# Altium project PMODBob.PrjPcb
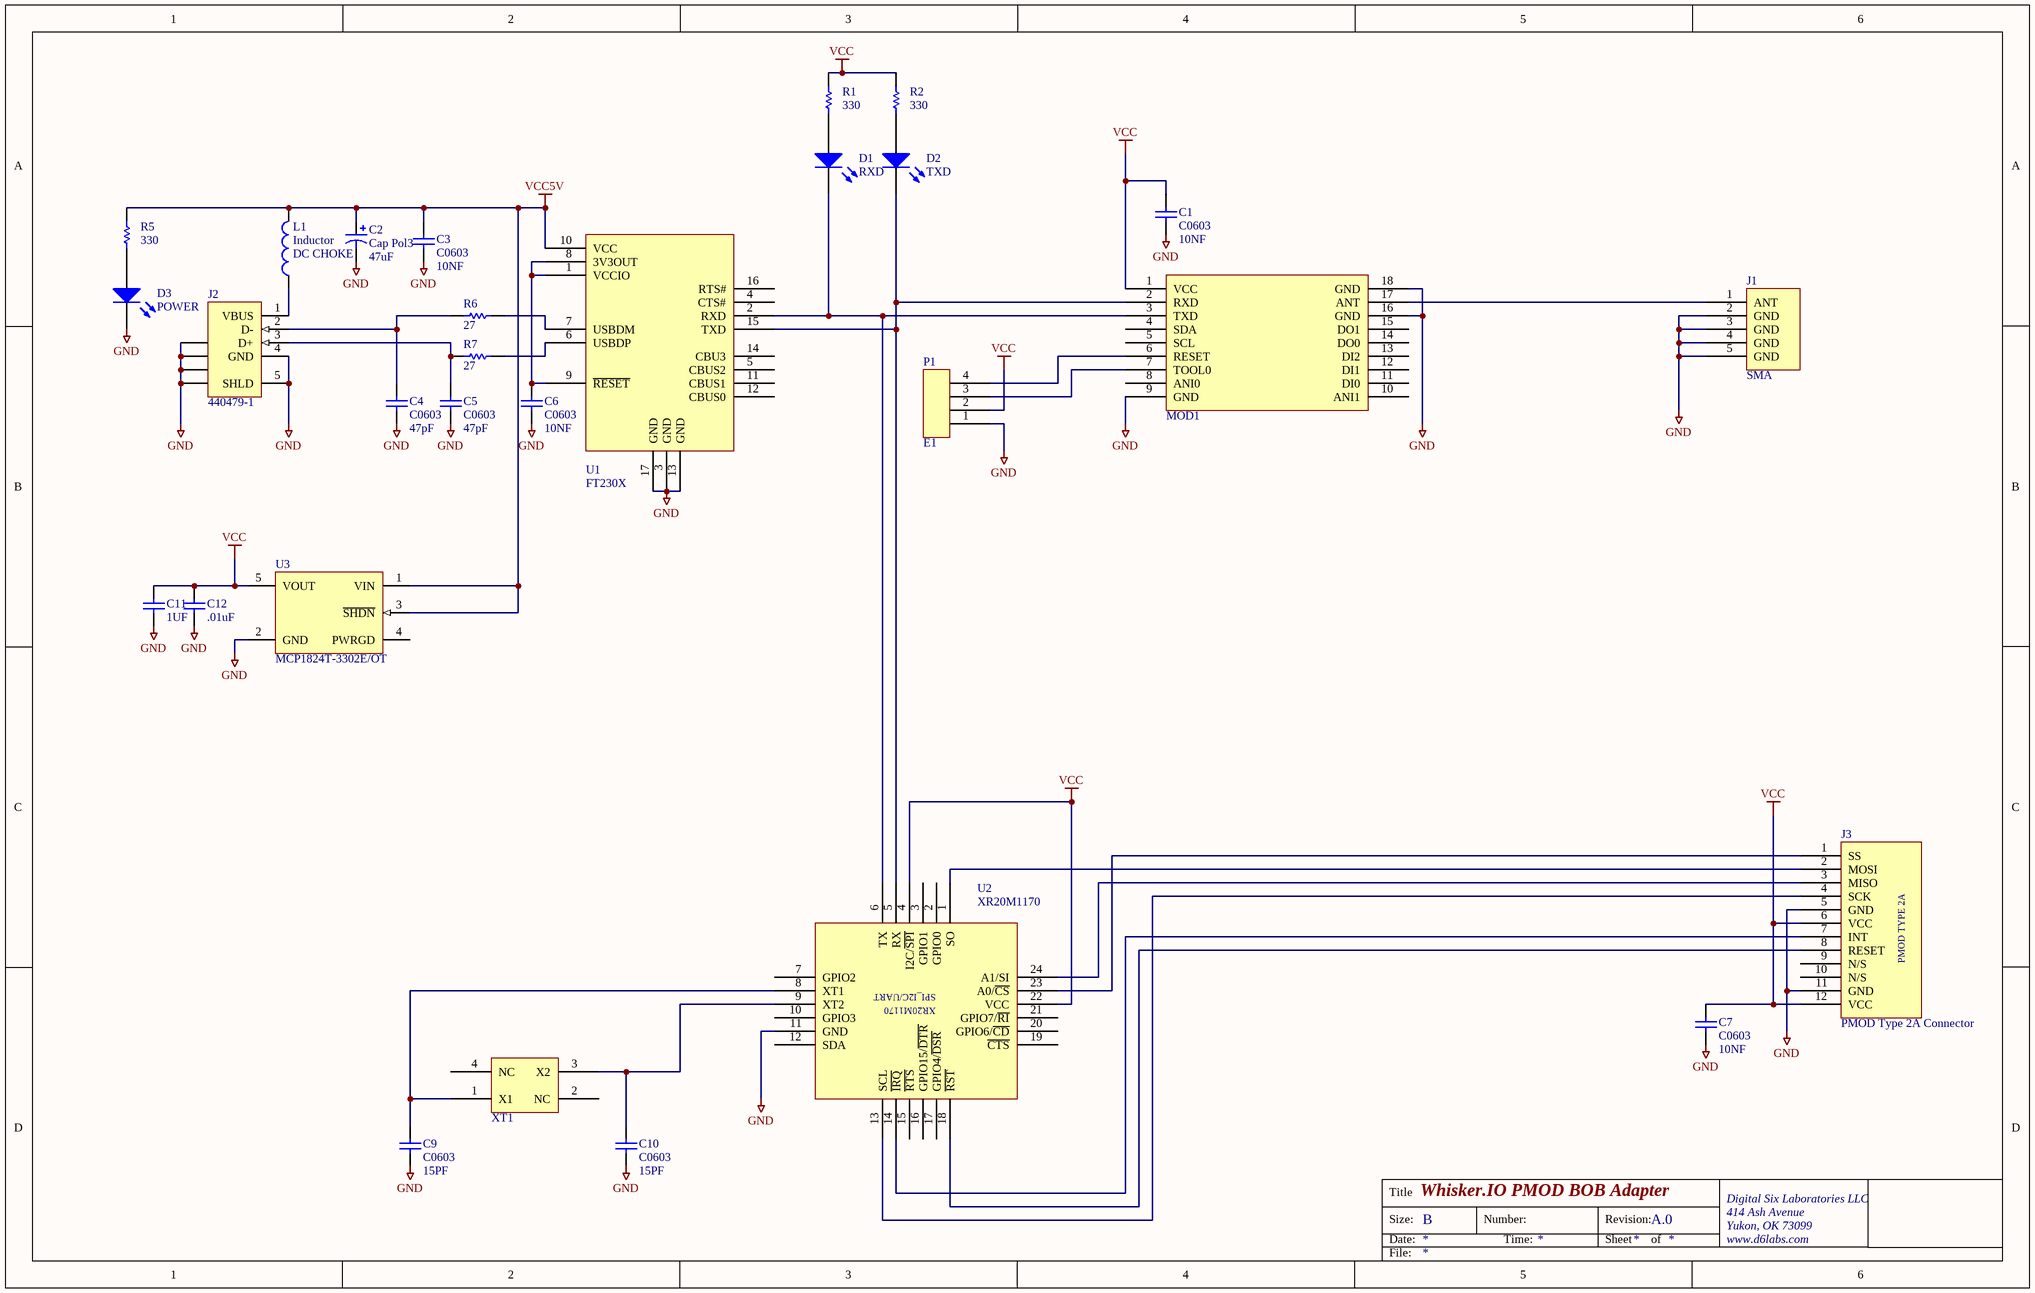
[diagram p0: PMODBob.SchDoc]
1 sheet, 29 parts. Net scope: global (net labels, ports and power ports of the same name join across sheets).
Board files: PMODBob.PcbDoc, opensourcehw_logo.PcbDoc

## Sheet PMODBob.SchDoc: Whisker.IO PMOD BOB Adapter
size B; Author: SJM; CompanyName: Digital Six Laboratories LLC; DrawnBy: SJM; Engineer: SJM; Address1: Digital Six Laboratories LLC; Address2: 414 Ash Avenue; Address3: Yukon, OK 73099; Address4: www.d6labs.com; Revision: A.0; PageSetup: Record=PageOptions|CenterHorizontal=True|CenterVertical=True|PrintScale=0.70|XCorrection=1.00|YCorrection=1.00|PrintKind=2|BorderSize=5000000|LeftOffset=0|BottomOffset=0|Orientation=2|PaperLength=4318|PaperWidth=2794|Scale=100|PaperSource=2|PrintQuality=-4|MediaType=1|DitherType=10|PaperKind=Letter|PrintScaleMode=1; DocumentName: PMOD BOB Adapter

### Parts
C1  C0603  value 10NF  [0603]
C2  Cap Pol3  value 47uF  [1812]
C3  C0603  value 10NF  [0603]
C4  C0603  value 47pF  [0603]
C5  C0603  value 47pF  [0603]
C6  C0603  value 10NF  [0603]
C7  C0603  value 10NF  [0603]
C9  C0603  value 15PF  [0603]
C10  C0603  value 15PF  [0603]
C11  1UF  [D6_0603_RES]
C12  .01uF  [D6_0603_RES]
D1  RXD  [3.2X1.6X1.1]
D2  TXD  [3.2X1.6X1.1]
D3  POWER  [3.2X1.6X1.1]
J1  SMA  [RPSMA-EDGEMOUNT]
J2  440479-1  [440479]
J3  PMOD Type 2A Connector  [Type2A]
L1  Inductor  value DC CHOKE  [INDC1608L]
MOD1  WhiskerModule  [whisker]  (value not drawn)
P1  E1  [2MM4PINHDR]
R1  330  [ERA-0603]
R2  330  [ERA-0603]
R5  330  [ERA-0603]
R6  27  [ERA-0603]
R7  27  [ERA-0603]
U1  FT230X  [QFN65P400X400X75-16N]
U2  XR20M1170  [QFN50P400X400X80-24N]
U3  MCP1824T-3302E/OT  [SOT-23-OT5_N]
XT1  2.5X3.2MM  [2.5x3.2]  (value not drawn)

### Nets
GND: C1.1 C2.2 C3.1 C4.1 C5.1 C6.1 C7.1 C9.1 C10.1 C11.1 C12.1 D3.2(K) J1.2(GND) J1.3(GND) J1.4(GND) J1.5(GND) J2.4(GND) J2.5(SHLD) J2.6(SHLD) J2.7(SHLD) J2.8(SHLD) J2.9(SHLD) J3.5(GND) J3.11(GND) MOD1.9(GND) MOD1.16(GND) MOD1.18(GND) P1.1(RESET) U1.3(GND) U1.13(GND) U1.17(GND) U2.11(GND) U3.2(GND)
VCC: C1.2 C7.2 C11.2 C12.2 J3.6(VCC) J3.12(VCC) MOD1.1(VCC) P1.2(RESET) R1.1 R2.1 U2.4(I2C/~{SPI}) U2.22(VCC) U3.5(VOUT)
VCC5V: C2.1 C3.2 L1.2 R5.1 U1.10(VCC) U3.1(VIN) U3.3(~{SHDN})
NetC4_2: C4.2 J2.2(D-) R6.2
NetC5_2: C5.2 J2.3(D+) R7.2
NetC6_2: C6.2 U1.1(VCCIO) U1.8(3V3OUT) U1.9(~{RESET})
NetC9_2: C9.2 U2.8(XT1) XT1.1(X1)
NetC10_2: C10.2 U2.9(XT2) XT1.3(X2)
NetD1_1: D1.1(A) R1.2
NetD1_2: D1.2(K) MOD1.3(TXD) U1.2(RXD) U2.6(TX)
NetD2_1: D2.1(A) R2.2
NetD2_2: D2.2(K) MOD1.2(RXD) U1.15(TXD) U2.5(RX)
NetD3_1: D3.1(A) R5.2
NetJ1_1: J1.1(ANT) MOD1.17(ANT)
NetJ2_1: J2.1(VBUS) L1.1
NetJ3_1: J3.1(SS) U2.23(A0/~{CS})
NetJ3_2: J3.2(MOSI) U2.1(SO)
NetJ3_3: J3.3(MISO) U2.24(A1/SI)
NetJ3_4: J3.4(SCK) U2.13(SCL)
NetJ3_7: J3.7(INT) U2.14(~{IRQ})
NetJ3_8: J3.8(RESET) U2.18(~{RST})
NetMOD1_6: MOD1.6(RESET) P1.4(RESET)
NetMOD1_7: MOD1.7(TOOL0) P1.3(RESET)
NetR6_1: R6.1 U1.7(USBDM)
NetR7_1: R7.1 U1.6(USBDP)

Not connected (* = marked no-connect by the designer): J3 9(N/S) 10(N/S); MOD1 4(SDA) 5(SCL) 8(ANI0) 10(ANI1) 11(DI0) 12(DI1) 13(DI2) 14(DO0) 15(DO1); U1 4(CTS#) 5(CBUS2) 11(CBUS1) 12(CBUS0) 14(CBU3) 16(RTS#); U2 2(GPIO0) 3(GPIO1) 7(GPIO2) 10(GPIO3) 12(SDA) 15(~{RTS}) 16(GPIO15/~{DTR}) 17(GPIO4/~{DSR}) 19(~{CTS}) 20(GPIO6/~{CD}) 21(GPIO7/~{RI}); U3 4(PWRGD); XT1 2(NC) 4(NC)

### Notes on the sheet
- Title
- Size:
- Date:
- B
- Number:
- Time:
- Revision:
- Sheet
- of
- File:
- (in symbol PMOD Type 2A Connector) PMOD TYPE 2A
- (in symbol XR20M1170) SPI_I2C/UART

### Library data of the parts
C1 C3 C6 C7 = C0603: Ceramic Chip Capacitor - Standard; VENDOR PART NUMBER: 140-CC504B103K-RC; MANUFACTURER: XICON; VENDOR: MOUSER; COST EACH: .008; MANUFACTURER PART NUMBER: 140-CC504B103K-RC
C2 = Cap Pol3: Polarized Capacitor (Surface Mount); VENDOR PART NUMBER: 647-F930J336MBA; MANUFACTURER: AVX; MANUFACTURER PART NUMBER: 647-647-F930J336MBA; VENDOR: MOUSER; COST EACH: .19
C4 C5 C9 C10 = C0603: Ceramic Chip Capacitor - Standard; VENDOR PART NUMBER: 140-CC504N470J-RC; MANUFACTURER: XICON; VENDOR: MOUSER; COST EACH: .009; MANUFACTURER PART NUMBER: 140-CC504N470J-RC
C11 C12 = C1210: Ceramic Chip Capacitor - Standard; MANUFACTURER: VISHAY; MANUFACTURER PART NUMBER: VJ0603A150JXACW1BC; VENDOR PART NUMBER: 77-VJ0603A150JXACW1BC; VENDOR: MOUSER; COST EACH: .02
D1-D3 = LED2: Typical RED, GREEN, YELLOW, AMBER GaAs LED; Published: 8-Jun-2000; LatestRevisionDate: 17-Jul-2002; LatestRevisionNote: Re-released for DXP Platform.; PackageVersion: Feb-2002; PackageReference: 3.2X1.6X1.1; Publisher: Altium Limited; PackageDescription: SM LED; 2 Flat Leads
J2 = 440479-1: USB 2.0, Right Angle, SMT, AB Type, Receptacle, 5 Position, Black; ContactMaterial: Phosphor Bronze; ContactPlating: Gold (30) over Nickel; PCB_Layout: Complies with manufacturer's recommendation.; DrillSize: Corresponds to nominal value.; PanelGround: Without; Published: 15-Jul-2004; DatasheetDocument: 28-Jan-2003; PackageDocument: 28-Jan-2003; PackageReference: 440479; Publisher: Altium Limited; HousingMaterial: Thermoplastic; ComponentLink1Description: Manufacturer Link; ComponentLink1URL: http://www.tycoelectronics.com/; ComponentLink2Description: Packaging Specification; ComponentLink2URL: http://ecommas.tycoelectronics.com/commerce/DocumentDelivery/DDEController?Action=showdoc&DocId=Customer+Drawing%7F440479%7FD%7Fpdf%7FEnglish%7FC_440479_D.pdf
L1 = Inductor: MANUFACTURER: TDK; MANUFACTURER PART NUMBER: MPZ1608D101B; VENDOR PART NUMBER: 810-MPZ1608D101B; COST EACH: .025; VENDOR: TDK
MOD1 = WhiskerModule: Whisker Footprint
P1 = 2MM4PINHDR
R1 R2 R5 = ERA3Y: Rectangular Thick Film Chip Resistor, 10 Ohm to 330k Ohm Range, 0.1% and 0.5% Tolerance, 0603 Size, 0.063 W; VENDOR PART NUMBER: 301-330-RC; MANUFACTURER: XICON; VENDOR: MOUSER; COST EACH: .003; MANUFACTURER PART NUMBER: 301-330-RC
R6 R7 = ERA3Y: Rectangular Thick Film Chip Resistor, 10 Ohm to 330k Ohm Range, 0.1% and 0.5% Tolerance, 0603 Size, 0.063 W; VENDOR PART NUMBER: 301-27-RC; MANUFACTURER: XICON; VENDOR: MOUSER; COST EACH: .003; MANUFACTURER PART NUMBER: 301-27-RC
U1 = FT230X: FT230X USB TO BASIC UART IC; MANUFACTURER: FTDI; MANUFACTURER PART NUMBER: FT230XQ; VENDOR PART NUMBER: 895-FT230XQ-R; VENDOR: MOUSER; COST EACH: 2.04
U2 = XR20M1170: I2C/SPI UART with 64-byte FIFO; MANUFACTURER: EXAR; MANUFACTURER PART NUMBER: XR20M1170IL24-F; VENDOR PART NUMBER: 701-XR20M1170IL24-F; VENDOR: MOUSER; COST EACH: 2.96
U3 = MCP1824T-3302E/OT: 300 mA, Low Voltage, Low Quiescent Current LDO Regulator, 5-Pin SOT-23, Extended Temperature, Tape and Reel; Published: 29-Jan-2009; DatasheetVersion: revA, Aug-2007; PackageVersion: revBB, Aug-2009; PackageReference: SOT-23-OT5; Publisher: Altium Limited; PackageDescription: 5-Lead Plastic Small Outline Transistor (OT) [SOT-23]; Supplier 1: Digi-Key; Supplier Part Number 1: MCP1824T-3302E/OTTR-ND; Supplier 2: Digi-Key; Supplier Part Number 2: MCP1824T-3302E/OTCT-ND; Supplier 3: Digi-Key; Supplier Part Number 3: MCP1824T-3302E/OTDKR-ND; Supplier 4: Farnell; Supplier Part Number 4: 1578387; Code_IPC: SOT23-5; ComponentLink1Description: Datasheet; ComponentLink1URL: http://ww1.microchip.com/downloads/en/DeviceDoc/22070a.pdf; ComponentLink2Description: Packaging Specification; ComponentLink2URL: http://www.microchip.com/stellent/groups/techpub_sg/documents/packagingspec/en012702.pdf; ComponentLink3Description: Microchip.com Home; ComponentLink3URL: http://www.microchip.com/
XT1 = 2.5X3.2MM: 3.2 X 2.5 MM